# Altium schematic sheet 8.Emulator_Interface.SchDoc
size A3; SheetNumber: 9; SheetTotal: 10
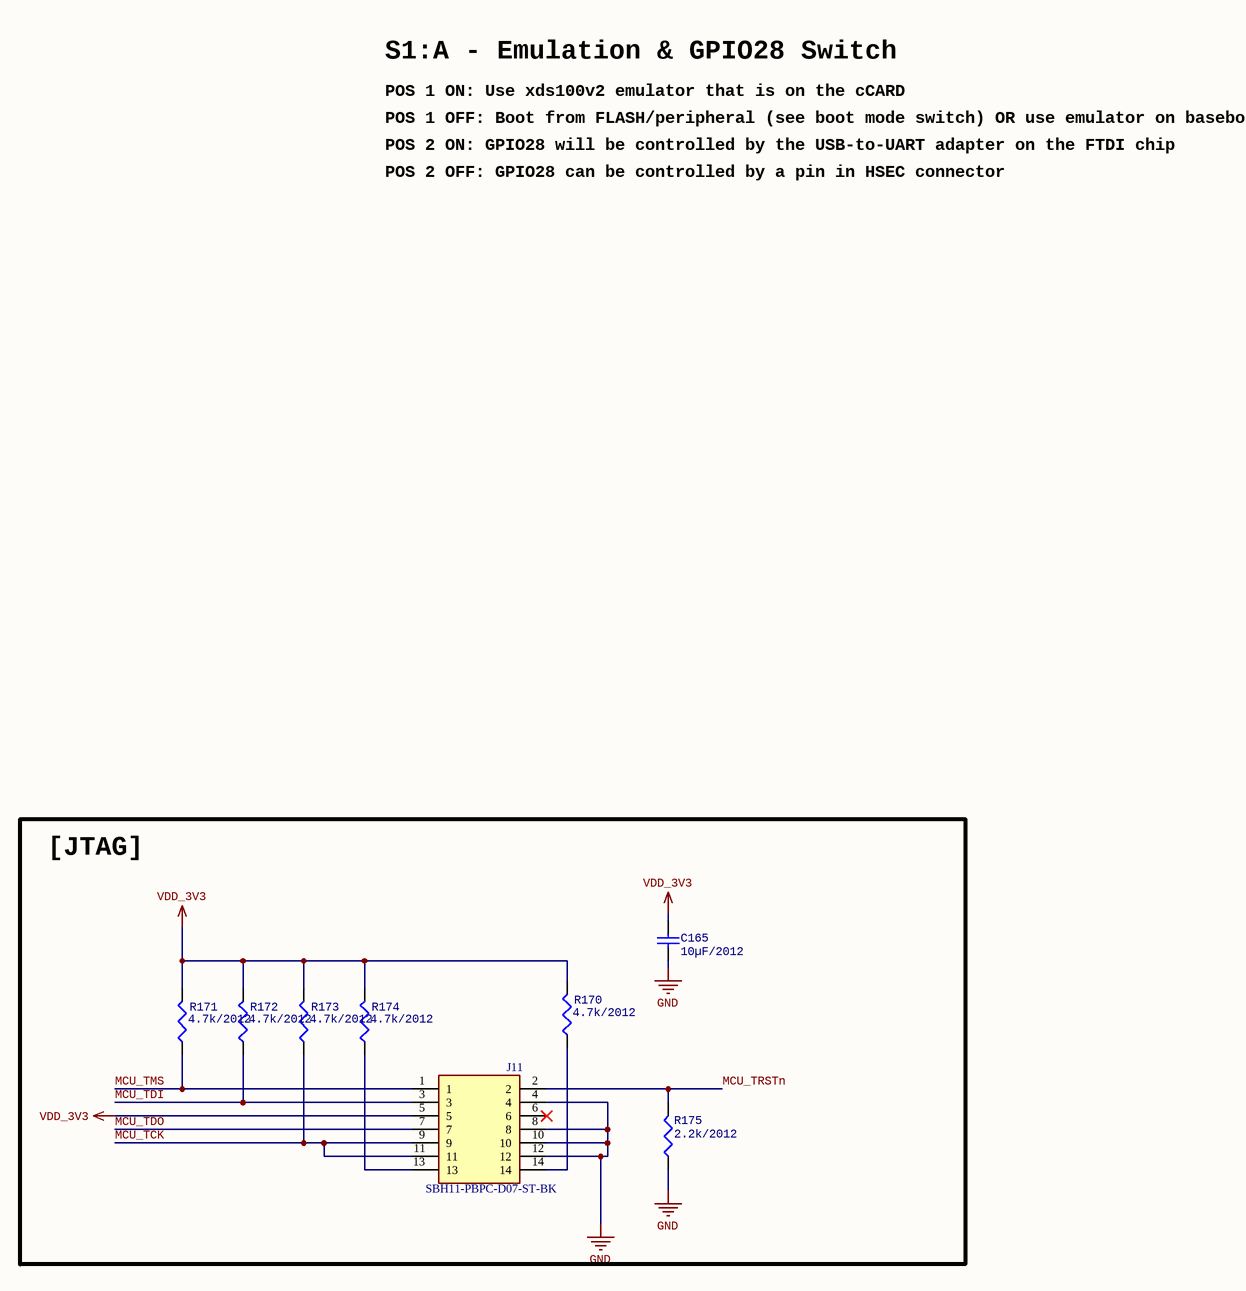
[diagram p0: 8.Emulator_Interface.SchDoc]

## Parts
C165  value 10µF/2012  [CAPC2013X135X45NL10T25]  (hidden comment: C2012)
J11  SBH11-PBPC-D07-ST-BK  [SULLINS_SBH11-PBPC-D07-ST-BK]
R170  value 4.7k/2012  [RESC0805(2012)_L]  (hidden comment: R2012)
R171  value 4.7k/2012  [RESC0805(2012)_L]  (hidden comment: R2012)
R172  value 4.7k/2012  [RESC0805(2012)_L]  (hidden comment: R2012)
R173  value 4.7k/2012  [RESC0805(2012)_L]  (hidden comment: R2012)
R174  value 4.7k/2012  [RESC0805(2012)_L]  (hidden comment: R2012)
R175  value 2.2k/2012  [RESC0805(2012)_L]  (hidden comment: R2012)

## Blocks framed on the sheet
[JTAG]: C165 J11 R170-R175

## Nets
GND: C165.2 J11.4 J11.8 J11.10 J11.12 R175.1
VDD_3V3: C165.1 J11.5 R170.2 R171.2 R172.2 R173.2 R174.2
MCU_TCK: J11.9 J11.11 R173.1
MCU_TDI: J11.3 R172.1
MCU_TDO: J11.7
MCU_TMS: J11.1 R171.1
MCU_TRSTn: J11.2 R175.2
NetJ11_13: J11.13 R174.1
NetJ11_14: J11.14 R170.1

Not connected (* = marked no-connect by the designer): J11 6*

## Notes on the sheet
- S1:A - Emulation & GPIO28 Switch
- POS 1 ON: Use xds100v2 emulator that is on the cCARD
- POS 1 OFF: Boot from FLASH/peripheral (see boot mode switch) OR use emulator on baseboard
- POS 2 ON: GPIO28 will be controlled by the USB-to-UART adapter on the FTDI chip
- POS 2 OFF: GPIO28 can be controlled by a pin in HSEC connector

## Library data of the parts
C165 = CMP-001-00007-7: Chip Capacitor, 1 uF, +/- 10%, 50 V, 0805 (2012 Metric); Voltage Rating: 50V; Capacitor Type: Ceramic; Case/Package: 0805; Min Operating Temperature: -55°C; Max Operating Temperature: 125°C; Pins: 2; Tolerance: 10%; RoHS Compliant: True; Mounting Technology: SM
J11 = CMP-002-00182-1: Connector Header Through Hole 14 position 0.100 (2.54mm); MF: Sullins Connector; Design Item ID: SBH11-PBPC-D07-ST-BK; Source: SBH11-PBPC-D07-ST-BK.SchLib; MP: SBH11-PBPC-D07-ST-BK; SnapEDA_Link: https://www.snapeda.com/parts/SBH11-PBPC-D07-ST-BK/Sullins/view-part/?ref=snap; Value: *; Check_prices: https://www.snapeda.com/parts/SBH11-PBPC-D07-ST-BK/Sullins/view-part/?ref=eda; Case/Package: None
R170-R175 = CMP-009-00174-4: Chip Resistor, 4,7 Ohms, +/-5 %, 125 mW, -55 to 155 degC, 0805; Power: 125mW; Tolerance: 5%; Max Operating Temperature: 155°C; Pins: 2; Case/Package: 0805; Min Operating Temperature: -55°C